# Altium project AOU_010.PrjPcb
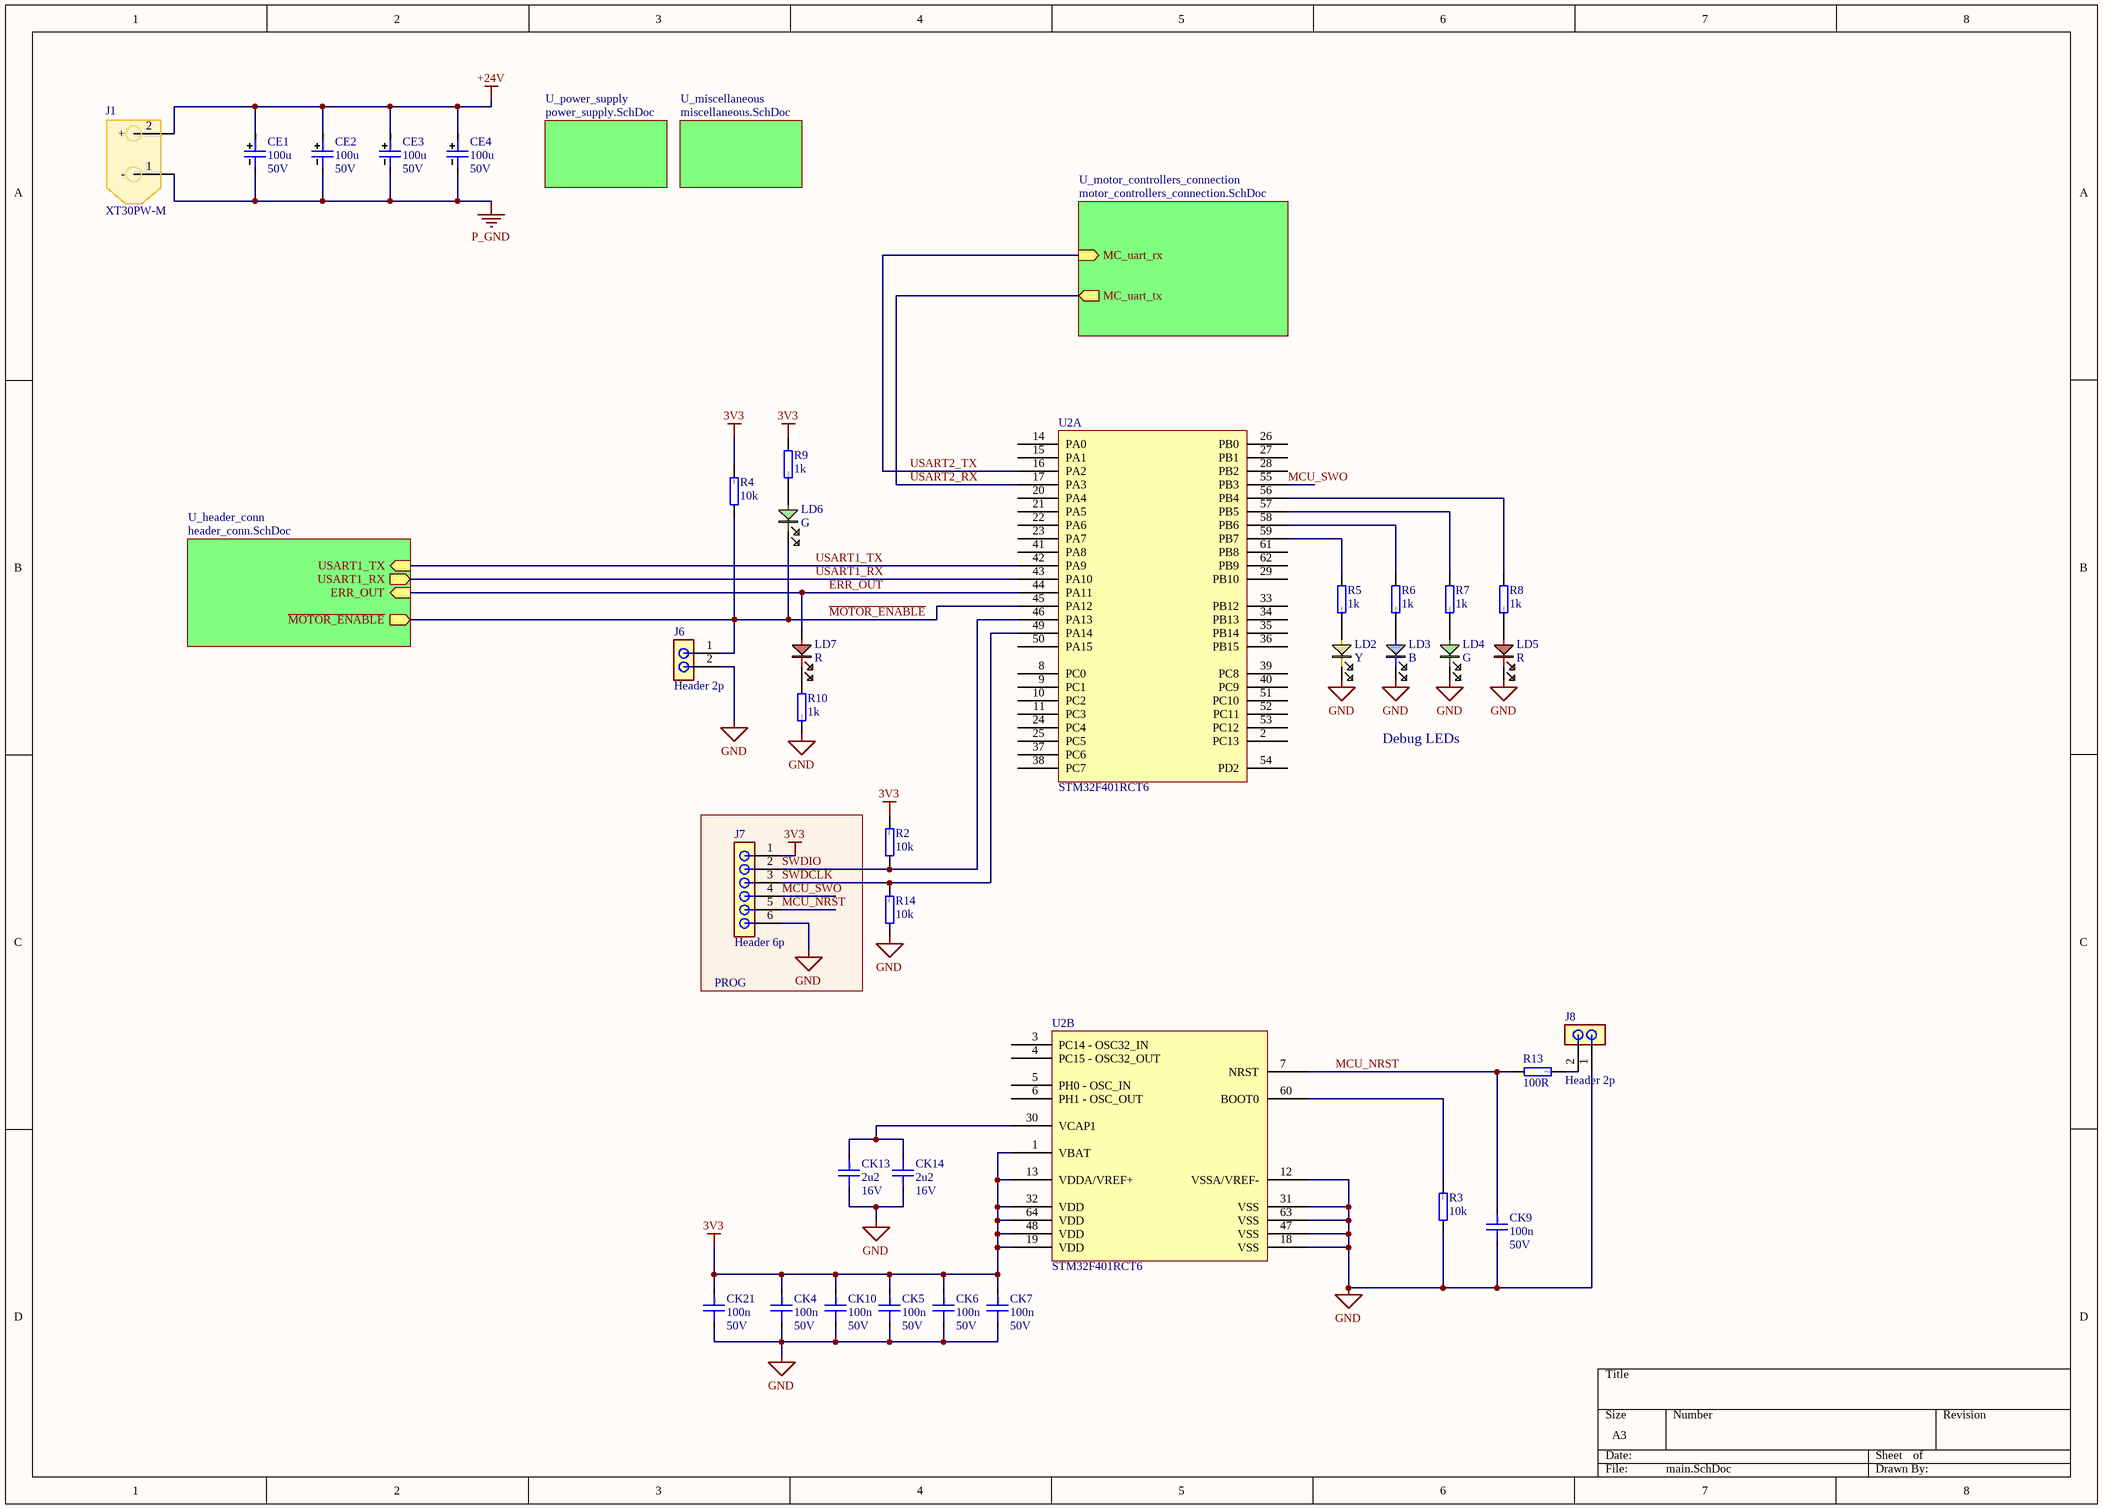
[diagram p0: main.SchDoc]
5 sheets, 81 parts. Net scope: hierarchical (ports join the sheet entries above them; power ports are global).
Board file: aou_pcb.PcbDoc
Sheets:
  main.SchDoc
    U_motor_controllers_connection = motor_controllers_connection.SchDoc
    U_header_conn = header_conn.SchDoc
    U_power_supply = power_supply.SchDoc
    U_miscellaneous = miscellaneous.SchDoc

## Sheet main.SchDoc: AOU010
size A3; SheetNumber: 1; SheetTotal: 5

### Parts
CE1  100u  Voltage rating: 50V  [CAPAE830X1100N]
CE2  100u  Voltage rating: 50V  [CAPAE830X1100N]
CE3  100u  Voltage rating: 50V  [CAPAE830X1100N]
CE4  100u  Voltage rating: 50V  [CAPAE830X1100N]
CK4  100n  Voltage rating: 50V  [CAP0603]
CK5  100n  Voltage rating: 50V  [CAP0603]
CK6  100n  Voltage rating: 50V  [CAP0603]
CK7  100n  Voltage rating: 50V  [CAP0603]
CK9  100n  Voltage rating: 50V  [CAP0603]
CK10  100n  Voltage rating: 50V  [CAP0603]
CK13  2u2  Voltage rating: 16V  [CAP0603]
CK14  2u2  Voltage rating: 16V  [CAP0603]
CK21  100n  Voltage rating: 50V  [CAP0603]
J1  XT30PW-M  [XT30PWM]
J6  Header 2p  [Pin header 2p]
J7  Header 6p  [Pin header 6p]
J8  Header 2p  [Pin header 2p]
LD2  Y  [0603_LED_Y]
LD3  B  [0603_LED_B]
LD4  G  [0603_LED_G]
LD5  R  [0603_LED_R]
LD6  G  [0603_LED_G]
LD7  R  [0603_LED_R]
R2  10k  [RESC2012X06N(SMR0805)]
R3  10k  [RESC2012X06N(SMR0805)]
R4  10k  [RESC2012X06N(SMR0805)]
R5  1k  [RESC2012X06N(SMR0805)]
R6  1k  [RESC2012X06N(SMR0805)]
R7  1k  [RESC2012X06N(SMR0805)]
R8  1k  [RESC2012X06N(SMR0805)]
R9  1k  [RESC2012X06N(SMR0805)]
R10  1k  [RESC2012X06N(SMR0805)]
R13  100R  [RESC2012X06N(SMR0805)]
R14  10k  [RESC2012X06N(SMR0805)]
U2  STM32F401RCT6  [LQFP64]  (parts A,B of 2)

### Blocks framed on the sheet
PROG: J7

### Sub-sheets
U_header_conn = header_conn.SchDoc: ~{MOTOR_ENABLE} (out), ERR_OUT (in), USART1_RX (out), USART1_TX (in)
U_miscellaneous = miscellaneous.SchDoc: no entries
U_motor_controllers_connection = motor_controllers_connection.SchDoc: MC_uart_tx (out), MC_uart_rx (in)
U_power_supply = power_supply.SchDoc: no entries

### Nets
3V3: CK4.1 CK5.1 CK6.1 CK7.1 CK10.1 CK21.1 J7.1 R2.2 R4.2 R9.1 U2.1(VBAT) U2.13(VDDA/VREF+) U2.19(VDD) U2.32(VDD) U2.48(VDD) U2.64(VDD)
+24V: CE1.1 CE2.1 CE3.1 CE4.1 J1.2(+)
GND: CK4.2 CK5.2 CK6.2 CK7.2 CK9.2 CK10.2 CK13.2 CK14.1 CK21.2 J6.2 J7.6 J8.1 LD2.2 LD3.2 LD4.2 LD5.2 R3.1 R10.2 R14.1 U2.12(VSSA/VREF-) U2.18(VSS) U2.31(VSS) U2.47(VSS) U2.63(VSS)
P_GND: CE1.2 CE2.2 CE3.2 CE4.2 J1.1(-)
~{MOTOR_ENABLE}: J6.1 LD6.2 R4.1 U2.45(PA12) ; sheet U_header_conn/~{MOTOR_ENABLE}
ERR_OUT: LD7.1 U2.44(PA11) ; sheet U_header_conn/ERR_OUT
MCU_NRST: CK9.1 J7.5 R13.1 U2.7(NRST)
MCU_SWO: J7.4 U2.55(PB3)
SWDCLK: J7.3 R14.2 U2.49(PA14)
SWDIO: J7.2 R2.1 U2.46(PA13)
USART1_RX: U2.43(PA10) ; sheet U_header_conn/USART1_RX
USART1_TX: U2.42(PA9) ; sheet U_header_conn/USART1_TX
USART2_RX: U2.17(PA3) ; sheet U_motor_controllers_connection/MC_uart_tx
USART2_TX: U2.16(PA2) ; sheet U_motor_controllers_connection/MC_uart_rx
NetCK13_1: CK13.1 CK14.2 U2.30(VCAP1)
NetJ8_2: J8.2 R13.2
NetLD2_1: LD2.1 R5.2
NetLD3_1: LD3.1 R6.2
NetLD4_1: LD4.1 R7.2
NetLD5_1: LD5.1 R8.2
NetLD6_1: LD6.1 R9.2
NetLD7_2: LD7.2 R10.1
NetR3_2: R3.2 U2.60(BOOT0)
NetR5_1: R5.1 U2.59(PB7)
NetR6_1: R6.1 U2.58(PB6)
NetR7_1: R7.1 U2.57(PB5)
NetR8_1: R8.1 U2.56(PB4)

Not connected (* = marked no-connect by the designer): U2 2(PC13) 3(PC14_-_OSC32_IN) 4(PC15_-_OSC32_OUT) 5(PH0_-_OSC_IN) 6(PH1_-_OSC_OUT) 8(PC0) 9(PC1) 10(PC2) 11(PC3) 14(PA0) 15(PA1) 20(PA4) 21(PA5) 22(PA6) 23(PA7) 24(PC4) 25(PC5) 26(PB0) 27(PB1) 28(PB2) 29(PB10) 33(PB12) 34(PB13) 35(PB14) 36(PB15) 37(PC6) 38(PC7) 39(PC8) 40(PC9) 41(PA8) 50(PA15) 51(PC10) 52(PC11) 53(PC12) 54(PD2) 61(PB8) 62(PB9)

### Notes on the sheet
- Debug LEDs
- (in symbol Cap 2u2 0603) 0603
- (in symbol Cap 100n 0603) 0603
- (in symbol Cap el 100u 50V) D8xL10.2mm

### Library data of the parts
CE1-CE4 = Cap el 100u 50V: 100uF 50V ±20% SMD,D8xL10.2mm Aluminum Electrolytic Capacitors - SMD ROHS; Basic: No; Value: 100u; JLCPCB Part: C3352; TME Part: CK1H107M08010VR
CK4-CK7 CK9 CK10 CK21 = Cap 100n 0603: 50V 100nF X7R ±10% 0603 Multilayer Ceramic Capacitors MLCC - SMD/SMT ROHS; Basic: Yes; Value: 100n; JLCPCB Part: C14663
CK13 CK14 = Cap 2u2 0603: 16V 2.2uF X5R ±10% 0603 Multilayer Ceramic Capacitors MLCC - SMD/SMT ROHS; Basic: Yes; Value: 2u2; JLCPCB Part: C23630
J1 = XT30 male: plug; Current: 15A; Basic: No; ComponentLink1Description: New link; ComponentLink1URL: https://www.tme.eu/cz/details/xt30pw-m/konektory-dc/amass/; JLCPCB Part: C431092; TME Part: XT30PW-M
J6 J8 = Pin header 2p: Connector; Manufacturer_Name: Connfly; Manufacturer_Part_Number: DS1021-1*2SF11-B; Basic: No; Datasheet Link: https://www.tme.com/Document/cc301e58a5da78cb543a94b5a5b7f06a/DS1021.pdf; Height: 5.88mm; JLCPCB Part: C492401
J7 = Pin header 6p: 3A Direct Insert Policy 6P -40℃~+105℃ 2.54mm Single Row Black Brass 1x6P Plugin,P=2.54mm Pin Headers ROHS; Manufacturer_Name: Connfly; Manufacturer_Part_Number: DS1021-1*2SF11-B; Datasheet Link: https://www.tme.com/Document/cc301e58a5da78cb543a94b5a5b7f06a/DS1021.pdf; Height: 5.88mm; JLCPCB Part: C37208
LD2 = LED Y 0603: 0603 Yellow Led; JLCPCB Part: C7496811
LD3 = LED B 0603: 0603 Blue Led; JLCPCB Part: C7496819
LD4 LD6 = LED G 0603: 0603 Green Led; JLCPCB Part: C22371297
LD5 LD7 = LED R 0603: -40℃~+85℃ Red 0603 LED Indication - Discrete ROHS; JLCPCB Part: C2286
R2-R4 R14 = Res 10k 0805: 125mW Thick Film Resistors 150V ±100ppm/℃ ±1% 10kΩ 0805 Chip Resistor - Surface Mount ROHS; Tolerance & Rating: 1%/0.1W; Basic: Yes; Value: 10k; Package: 0805; SMD: 1; ComponentLink3Description: rezistor čip; ComponentLink3URL: heliosgreen://v1/hegMT/5-MT/Classes(343)/Folders/OpenForm?RecordNumbers=[381513]; JLCPCB Part: C17414
R5-R10 = Res 1k 0805: 125mW Thick Film Resistors 150V ±100ppm/℃ ±1% 1kΩ 0805 Chip Resistor - Surface Mount ROHS; Tolerance & Rating: 1%/0.1W; Basic: Yes; Value: 1k; Package: 0805; Author: JP/27.03.2014; SMD: 1; ComponentLink3Description: rezistor čip; ComponentLink3URL: heliosgreen://v1/hegMT/5-MT/Classes(343)/Folders/OpenForm?RecordNumbers=[381513]; JLCPCB Part: C17513
R13 = Res 100R 0805: 125mW Thick Film Resistors 150V ±100ppm/℃ ±1% 100Ω 0805 Chip Resistor - Surface Mount ROHS; Tolerance & Rating: 1%/0.1W; Basic: Yes; Value: 100R; Package: 0805; Author: JP/27.03.2014; SMD: 1; ComponentLink3Description: rezistor čip; ComponentLink3URL: heliosgreen://v1/hegMT/5-MT/Classes(343)/Folders/OpenForm?RecordNumbers=[381513]; JLCPCB Part: C17408
U2 = STM32F401RCT6: 256KB 1.7V~3.6V ARM-M4 64KB 84MHz FLASH 50 LQFP-64(10x10) Microcontrollers (MCU/MPU/SOC) ROHS; Basic: No; JLCPCB Part: C74524

## Sheet motor_controllers_connection.SchDoc
size A3; SheetNumber: 2; SheetTotal: 5
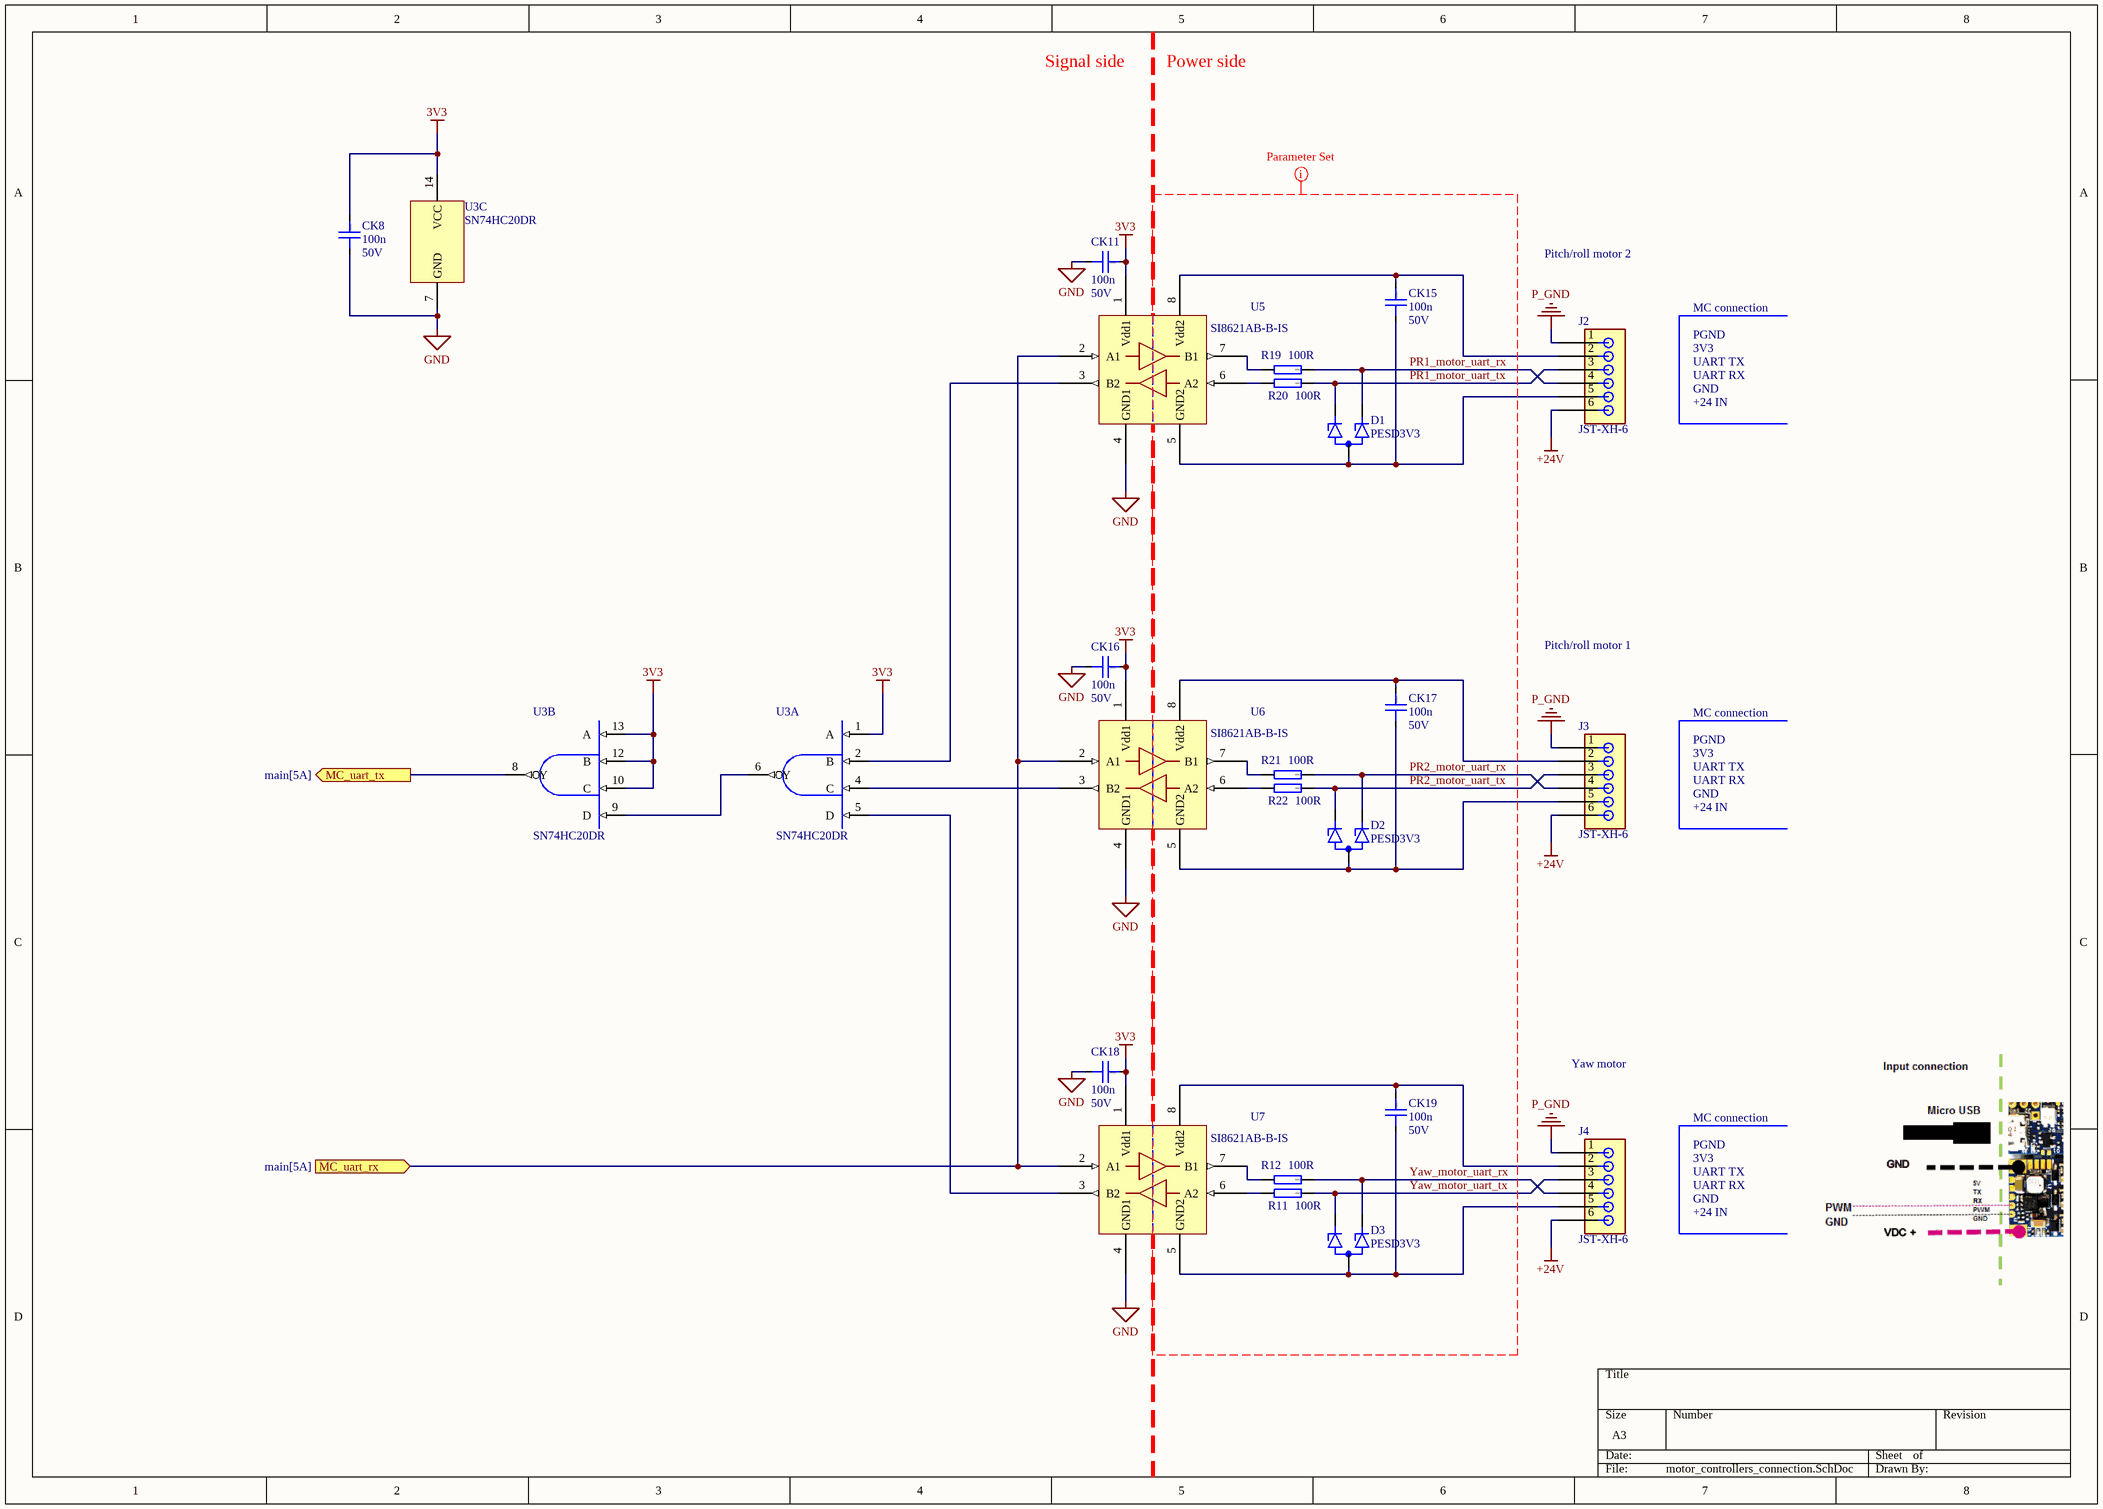
[diagram p1: motor_controllers_connection.SchDoc]

### Parts
CK8  100n  Voltage rating: 50V  [CAP0603]
CK11  100n  Voltage rating: 50V  [CAP0603]
CK15  100n  Voltage rating: 50V  [CAP0603]
CK16  100n  Voltage rating: 50V  [CAP0603]
CK17  100n  Voltage rating: 50V  [CAP0603]
CK18  100n  Voltage rating: 50V  [CAP0603]
CK19  100n  Voltage rating: 50V  [CAP0603]
D1  PESD3V3  [SOT95P230X110-3N(SOT23)]
D2  PESD3V3  [SOT95P230X110-3N(SOT23)]
D3  PESD3V3  [SOT95P230X110-3N(SOT23)]
J2  JST-XH-6  [JST-XH-6]
J3  JST-XH-6  [JST-XH-6]
J4  JST-XH-6  [JST-XH-6]
R11  100R  [RESC2012X06N(SMR0805)]
R12  100R  [RESC2012X06N(SMR0805)]
R19  100R  [RESC2012X06N(SMR0805)]
R20  100R  [RESC2012X06N(SMR0805)]
R21  100R  [RESC2012X06N(SMR0805)]
R22  100R  [RESC2012X06N(SMR0805)]
U3  SN74HC20DR  [SOIC14]  (parts A,B,C of 3)
U5  SI8621AB-B-IS  [SOIC8]
U6  SI8621AB-B-IS  [SOIC8]
U7  SI8621AB-B-IS  [SOIC8]

### Ports
MC_uart_rx (in, see main[5A]), MC_uart_tx (out, see main[5A])

### Nets
3V3: CK8.1 CK11.1 CK16.1 CK18.1 U3.1(A) U3.10(C) U3.12(B) U3.13(A) U3.14(VCC) U5.1(Vdd1) U6.1(Vdd1) U7.1(Vdd1)
+24V: J2.6 J3.6 J4.6
GND: CK8.2 CK11.2 CK16.2 CK18.2 U3.7(GND) U5.4(GND1) U6.4(GND1) U7.4(GND1)
P_GND: J2.1 J3.1 J4.1
PR1_motor_uart_rx: D1.1(K1) J2.4 R19.2
PR1_motor_uart_tx: D1.2(K2) J2.3 R20.2
PR2_motor_uart_rx: D2.1(K1) J3.4 R21.2
PR2_motor_uart_tx: D2.2(K2) J3.3 R22.2
USART2_RX: U3.8(Y) ; port MC_uart_tx
USART2_TX: U5.2(A1) U6.2(A1) U7.2(A1) ; port MC_uart_rx
Yaw_motor_uart_rx: D3.1(K1) J4.4 R12.2
Yaw_motor_uart_tx: D3.2(K2) J4.3 R11.2
NetCK15_1: CK15.1 J2.2 U5.8(Vdd2)
NetCK15_2: CK15.2 D1.3(A) J2.5 U5.5(GND2)
NetCK17_1: CK17.1 J3.2 U6.8(Vdd2)
NetCK17_2: CK17.2 D2.3(A) J3.5 U6.5(GND2)
NetCK19_1: CK19.1 J4.2 U7.8(Vdd2)
NetCK19_2: CK19.2 D3.3(A) J4.5 U7.5(GND2)
NetR11_1: R11.1 U7.6(A2)
NetR12_1: R12.1 U7.7(B1)
NetR19_1: R19.1 U5.7(B1)
NetR20_1: R20.1 U5.6(A2)
NetR21_1: R21.1 U6.7(B1)
NetR22_1: R22.1 U6.6(A2)
NetU3_2: U3.2(B) U5.3(B2)
NetU3_4: U3.4(C) U6.3(B2)
NetU3_5: U3.5(D) U7.3(B2)
NetU3_6: U3.6(Y) U3.9(D)

### Layout directives
net class MC_isol: PR1_motor_uart_rx, PR1_motor_uart_tx, PR2_motor_uart_rx, PR2_motor_uart_tx, Yaw_motor_uart_rx, Yaw_motor_uart_tx

### Notes on the sheet
- Signal side
- Power side
- Pitch/roll motor 2
- MC connection
- PGND
- 3V3
- UART RX
- UART TX
- GND
- +24 IN
- Pitch/roll motor 1
- Yaw motor
- (in symbol Cap 100n 0603) 0603

### Library data of the parts
CK8 CK11 CK15-CK19 = Cap 100n 0603: as CK4 on sheet main; Value: 100n; JLCPCB Part: C14663
D1-D3 = PESD3V3S2UT,215: 18A 20V 5.2V Unidirectional 3.3V SOT-23 ESD and Surge Protection (TVS/ESD) ROHS; Basic: No; JLCPCB Part: C84276; TME Part: PESD3V3S2UT.215
J2-J4 = JST-HX-6: 1x6P 6P XH Tin 6 -25℃~+85℃ 3A 1 2.5mm Brass Bend insert Push-Pull,P=2.5mm Wire To Board Connector ROHS; S6B-XH-A(LF)(SN); Basic: No; JLCPCB Part: C157919; TME Part: S6B-XH-A
R11 R12 R19-R22 = Res 100R 0805: as R13 on sheet main; Value: 100R; Package: 0805; Author: JP/27.03.2014; SMD: 1; ComponentLink3Description: rezistor čip; ComponentLink3URL: heliosgreen://v1/hegMT/5-MT/Classes(343)/Folders/OpenForm?RecordNumbers=[381513]; JLCPCB Part: C17408
U3 = SN74HC20DR: 2V~6V 2uA 2 19ns@6V,50pF NAND Gates SOIC-14 Logic Gates ROHS; Basic: No; JLCPCB Part: C2867684; TME Part: SN74HC20DR
U5-U7 = SI8621AB-B-IS: SOIC-8 Digital Isolators ROHS; Basic: No; JLCPCB Part: C430265; TME Part: SI8621AB-B-IS

## Sheet header_conn.SchDoc
size A4; SheetNumber: 3; SheetTotal: 5
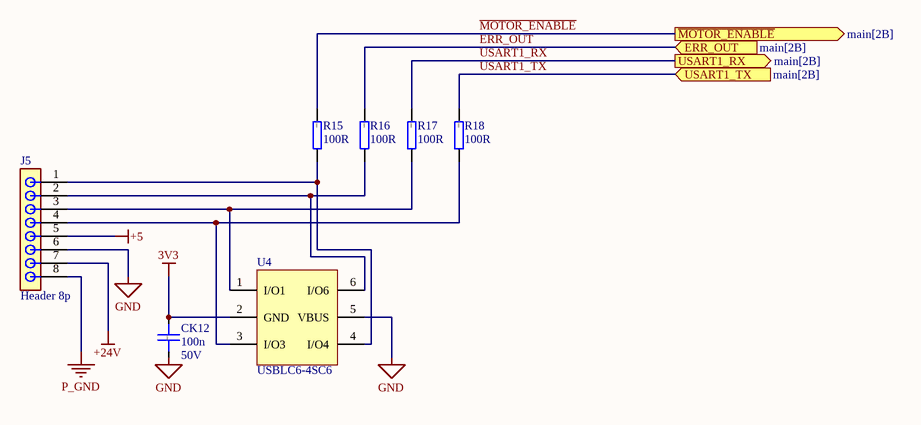
[diagram p2: header_conn.SchDoc]

### Parts
CK12  100n  Voltage rating: 50V  [CAP0603]
J5  Header 8p  [Pin header 8p]
R15  100R  [RESC2012X06N(SMR0805)]
R16  100R  [RESC2012X06N(SMR0805)]
R17  100R  [RESC2012X06N(SMR0805)]
R18  100R  [RESC2012X06N(SMR0805)]
U4  USBLC6-4SC6  [SOT23-6]

### Ports
ERR_OUT (in, see main[2B]), USART1_RX (out, see main[2B]), USART1_TX (in, see main[2B]), ~{MOTOR_ENABLE} (out, see main[2B])

### Nets
3V3: CK12.1 U4.2(GND)
+5: J5.5
+24V: J5.7
GND: CK12.2 J5.6 U4.5(VBUS)
P_GND: J5.8
~{MOTOR_ENABLE}: R15.2 ; port ~{MOTOR_ENABLE}
ERR_OUT: R16.2 ; port ERR_OUT
USART1_RX: R17.2 ; port USART1_RX
USART1_TX: R18.2 ; port USART1_TX
NetJ5_1: J5.1 R15.1 U4.4(I/O4)
NetJ5_2: J5.2 R16.1 U4.6(I/O6)
NetJ5_3: J5.3 R17.1 U4.1(I/O1)
NetJ5_4: J5.4 R18.1 U4.3(I/O3)

### Notes on the sheet
- (in symbol Cap 100n 0603) 0603

### Library data of the parts
CK12 = Cap 100n 0603: as CK4 on sheet main; Value: 100n; JLCPCB Part: C14663
J5 = Pin header 8p: 3A Direct Insert Policy 6P -40℃~+105℃ 2.54mm Single Row Black Brass 1x6P Plugin,P=2.54mm Pin Headers ROHS; Manufacturer_Name: Connfly; Manufacturer_Part_Number: DS1021-1*2SF11-B; Datasheet Link: https://www.tme.com/Document/cc301e58a5da78cb543a94b5a5b7f06a/DS1021.pdf; Height: 5.88mm; JLCPCB Part: C37208
R15-R18 = Res 100R 0805: as R13 on sheet main; Value: 100R; Package: 0805; Author: JP/27.03.2014; SMD: 1; ComponentLink3Description: rezistor čip; ComponentLink3URL: heliosgreen://v1/hegMT/5-MT/Classes(343)/Folders/OpenForm?RecordNumbers=[381513]; JLCPCB Part: C17408
U4 = USBLC6-4SC6: 5A 17V 6V Unidirectional 5.25V SOT-23-6 ESD and Surge Protection (TVS/ESD) ROHS; Basic: No; JLCPCB Part: C111212; TME Part: USBLC6-4SC6

## Sheet power_supply.SchDoc
size A4; SheetNumber: 4; SheetTotal: 5
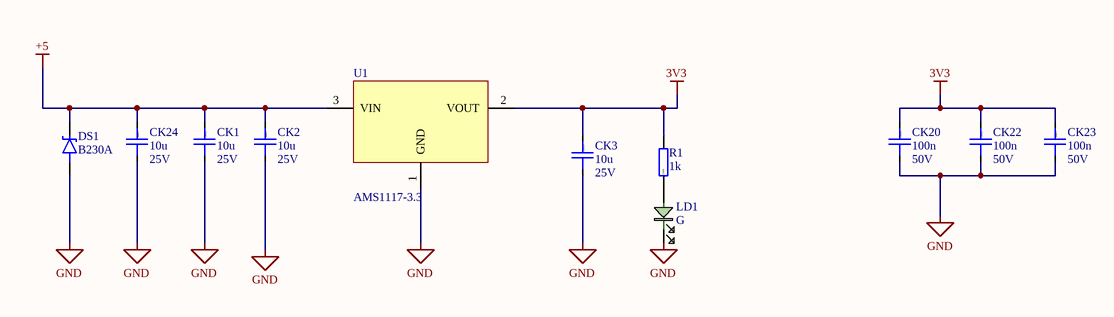
[diagram p3: power_supply.SchDoc]

### Parts
CK1  10u  Voltage rating: 25V  [CAP0805]
CK2  10u  Voltage rating: 25V  [CAP0805]
CK3  10u  Voltage rating: 25V  [CAP0805]
CK20  100n  Voltage rating: 50V  [CAP0603]
CK22  100n  Voltage rating: 50V  [CAP0603]
CK23  100n  Voltage rating: 50V  [CAP0603]
CK24  10u  Voltage rating: 25V  [CAP0805]
DS1  B230A  [DIOM4326X23M]
LD1  G  [0603_LED_G]
R1  1k  [RESC2012X06N(SMR0805)]
U1  AMS1117-3.3  [SOT230P700X180-4M]

### Nets
3V3: CK3.1 CK20.1 CK22.1 CK23.1 R1.1 U1.2(VOUT)
+5: CK1.1 CK2.1 CK24.1 DS1.1 U1.3(VIN)
GND: CK1.2 CK2.2 CK3.2 CK20.2 CK22.2 CK23.2 CK24.2 DS1.2 LD1.2 U1.1(GND)
NetLD1_1: LD1.1 R1.2

### Notes on the sheet
- (in symbol Cap 10u 0805) 0805
- (in symbol Cap 100n 0603) 0603

### Library data of the parts
CK1-CK3 CK24 = Cap 10u 0805: 25V 10uF X5R ±10% 0805 Multilayer Ceramic Capacitors MLCC - SMD/SMT ROHS; Basic: Yes; JLCPCB Part: C15850; Value: 10u
CK20 CK22 CK23 = Cap 100n 0603: as CK4 on sheet main; Value: 100n; JLCPCB Part: C14663
DS1 = B230A-13-F: 30V 500mV@2A 2A SMA(DO-214AC) Schottky Diodes ROHS; JLCPCB Part: C12889
LD1 = LED G 0603: 0603 Green Led; JLCPCB Part: C22371297
R1 = Res 1k 0805: as R5 on sheet main; Value: 1k; Package: 0805; Author: JP/27.03.2014; SMD: 1; ComponentLink3Description: rezistor čip; ComponentLink3URL: heliosgreen://v1/hegMT/5-MT/Classes(343)/Folders/OpenForm?RecordNumbers=[381513]; JLCPCB Part: C17513
U1 = AMS1117-3.3: 72dB@(120Hz) 1A Fixed 3.3V Positive electrode SOT-223 Voltage Regulators - Linear, Low Drop Out (LDO) Regulators ROHS; Basic: Yes; JLCPCB Part: C6186

## Sheet miscellaneous.SchDoc
size A4; SheetNumber: 5; SheetTotal: 5
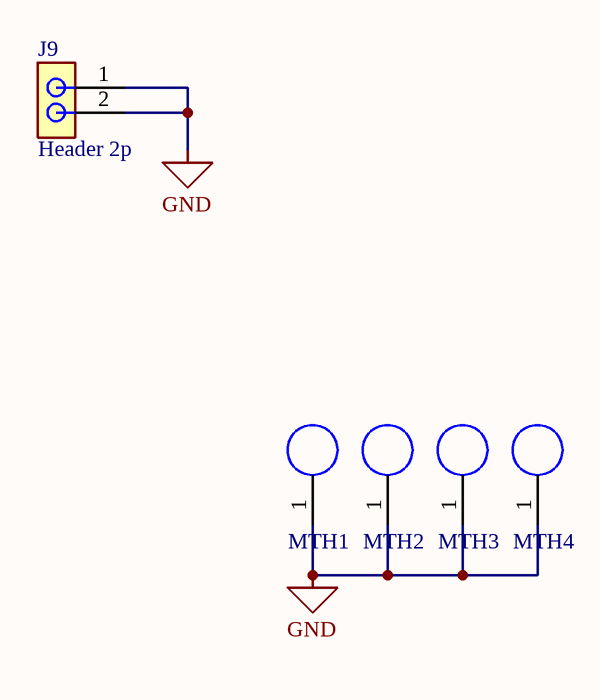
[diagram p4: miscellaneous.SchDoc]

### Parts
J9  Header 2p  [Pin header 2p]
MTH1  Hole  [3.2/6 MM]  (value not drawn)  (no BOM)
MTH2  Hole  [3.2/6 MM]  (value not drawn)  (no BOM)
MTH3  Hole  [3.2/6 MM]  (value not drawn)  (no BOM)
MTH4  Hole  [3.2/6 MM]  (value not drawn)  (no BOM)

### Nets
GND: J9.1 J9.2 MTH1.1 MTH2.1 MTH3.1 MTH4.1

### Library data of the parts
J9 = Pin header 2p: as J6 on sheet main; Datasheet Link: https://www.tme.com/Document/cc301e58a5da78cb543a94b5a5b7f06a/DS1021.pdf; Height: 5.88mm; JLCPCB Part: C492401
MTH1-MTH4 = Hole: Universal mounting hole plated

## Nets that join several sheets
3V3: main (16 pins), motor_controllers_connection (12 pins), header_conn (CK12.1 U4.2), power_supply (6 pins)
+5: header_conn (J5.5), power_supply (5 pins)
+24V: main (5 pins), motor_controllers_connection (J2.6 J3.6 J4.6), header_conn (J5.7)
GND: main (24 pins), motor_controllers_connection (8 pins), header_conn (CK12.2 J5.6 U4.5), power_supply (10 pins), miscellaneous (6 pins)
P_GND: main (5 pins), motor_controllers_connection (J2.1 J3.1 J4.1), header_conn (J5.8)
~{MOTOR_ENABLE}: main (J6.1 LD6.2 R4.1 U2.45), header_conn (R15.2)
ERR_OUT: main (LD7.1 U2.44), header_conn (R16.2)
USART1_RX: main (U2.43), header_conn (R17.2)
USART1_TX: main (U2.42), header_conn (R18.2)
USART2_RX: main (U2.17), motor_controllers_connection (U3.8)
USART2_TX: main (U2.16), motor_controllers_connection (U5.2 U6.2 U7.2)

## Assembly variants
jlcpcb_pcba: not fitted J1 J6 J7 J8 LD2 LD3 LD4 LD5 LD6 U2